# EAGLE design usbmidi2cv (EAGLE 9.6.2)
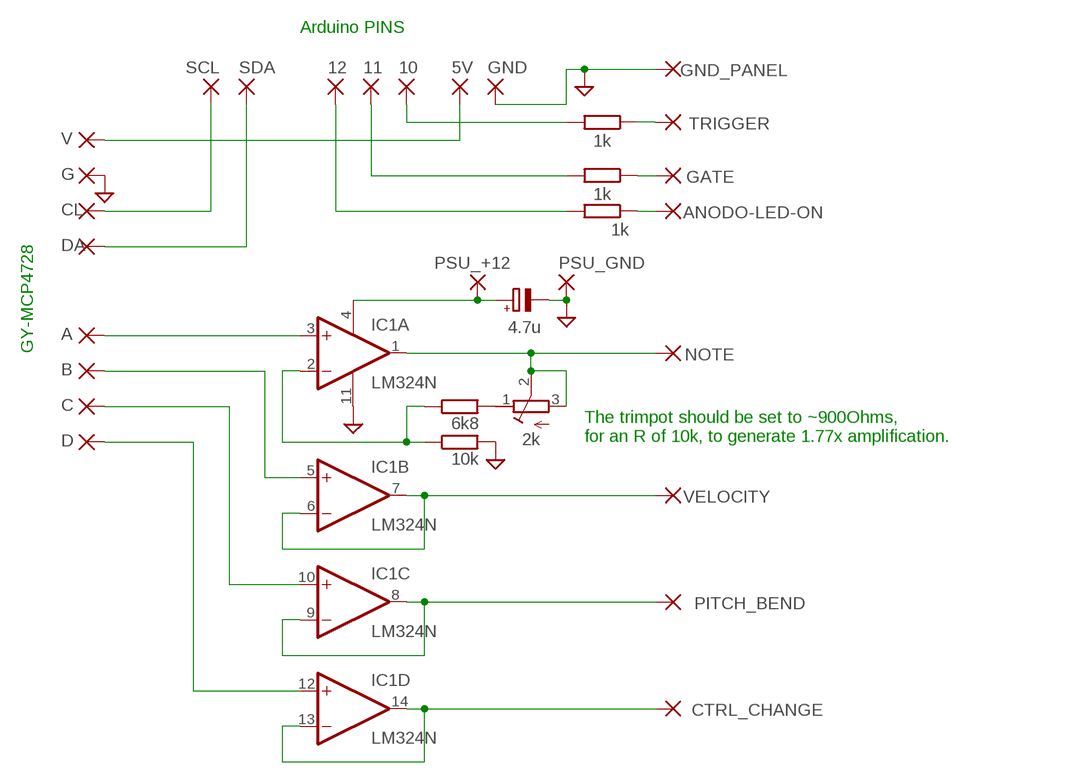
[diagram p0: schematic, sheet 1]

## Parts
5V  1,6/0,8  [1,6/0,8]
10  1,6/0,8  [1,6/0,8]
11  1,6/0,8  [1,6/0,8]
12  1,6/0,8  [1,6/0,8]
A  1,6/0,8  [1,6/0,8]
ANODO-LED-ON  1,6/0,8  [1,6/0,8]
B  1,6/0,8  [1,6/0,8]
C  1,6/0,8  [1,6/0,8]
C1  4.7u  CPOL-EUE2.5-6  [E2,5-6]
CL  1,6/0,8  [1,6/0,8]
CTRL_CHANGE  1,6/0,8  [1,6/0,8]
D  1,6/0,8  [1,6/0,8]
DA  1,6/0,8  [1,6/0,8]
G  1,6/0,8  [1,6/0,8]
GATE  1,6/0,8  [1,6/0,8]
GND  1,6/0,8  [1,6/0,8]
GND_PANEL  1,6/0,8  [1,6/0,8]
IC1  LM324N  [DIL14]
NOTE  1,6/0,8  [1,6/0,8]
PITCH_BEND  1,6/0,8  [1,6/0,8]
PSU_+12  1,6/0,8  [1,6/0,8]
PSU_GND  1,6/0,8  [1,6/0,8]
R1  1k  R-EU_0204/7  [0204/7]
R2  1k  R-EU_0204/7  [0204/7]
R3  1k  R-EU_0204/7  [0204/7]
R4  10k  R-EU_0207/12  [0207/12]
R5  2k  R-TRIMM3006P  [RTRIM3006P]
R6  6k8  R-EU_0207/12  [0207/12]
SCL  1,6/0,8  [1,6/0,8]
SDA  1,6/0,8  [1,6/0,8]
TRIGGER  1,6/0,8  [1,6/0,8]
V  1,6/0,8  [1,6/0,8]
VELOCITY  1,6/0,8  [1,6/0,8]

## Nets
GND: C1.- G.1(P) GND.1(P) GND_PANEL.1(P) IC1.11(P:V-) PSU_GND.1(P) R4.2
N$1: A.1(P) IC1.3(A:+IN)
N$2: R2.1 TRIGGER.1(P)
N$3: GATE.1(P) R1.1
N$4: 10.1(P) R2.2
N$5: 11.1(P) R1.2
N$6: ANODO-LED-ON.1(P) R3.1
N$7: 12.1(P) R3.2
N$8: 5V.1(P) V.1(P)
N$9: CL.1(P) SCL.1(P)
N$10: DA.1(P) SDA.1(P)
N$11: B.1(P) IC1.5(B:+IN)
N$12: C.1(P) IC1.10(C:+IN)
N$13: CTRL_CHANGE.1(P) IC1.13(D:-IN) IC1.14(D:OUT)
N$14: IC1.1(A:OUT) NOTE.1(P) R5.2(S) R5.3(A)
N$15: IC1.8(C:OUT) IC1.9(C:-IN) PITCH_BEND.1(P)
N$16: IC1.6(B:-IN) IC1.7(B:OUT) VELOCITY.1(P)
N$17: IC1.2(A:-IN) R4.1 R6.1
N$18: R5.1(E) R6.2
N$19: C1.+ IC1.4(P:V+) PSU_+12.1(P)
N$20: D.1(P) IC1.12(D:+IN)

## Notes on the sheet
- Arduino PINS
- GY-MCP4728
- The trimpot should be set to ~900Ohms,
  for an R of 10k, to generate 1.77x amplification.

## Library data of the parts
5V 10-12 A ANODO-LED-ON B C CL CTRL_CHANGE D DA G GATE GND GND_PANEL NOTE PITCH_BEND PSU_+12 PSU_GND SCL SDA TRIGGER V VELOCITY = wirepad:1,6/0,8: THROUGH-HOLE PAD
C1 = rcl:CPOL-EU: POLARIZED CAPACITOR, European symbol; SPICEPREFIX: C
IC1 = linear:LM324: OP AMP
R1-R4 R6 = rcl:R-EU_: RESISTOR, European symbol; SPICEPREFIX: R
R5 = rcl:R-TRIMM: Trimm resistor; SPICEMODEL: X; SPICEPREFIXL: POT

## Board
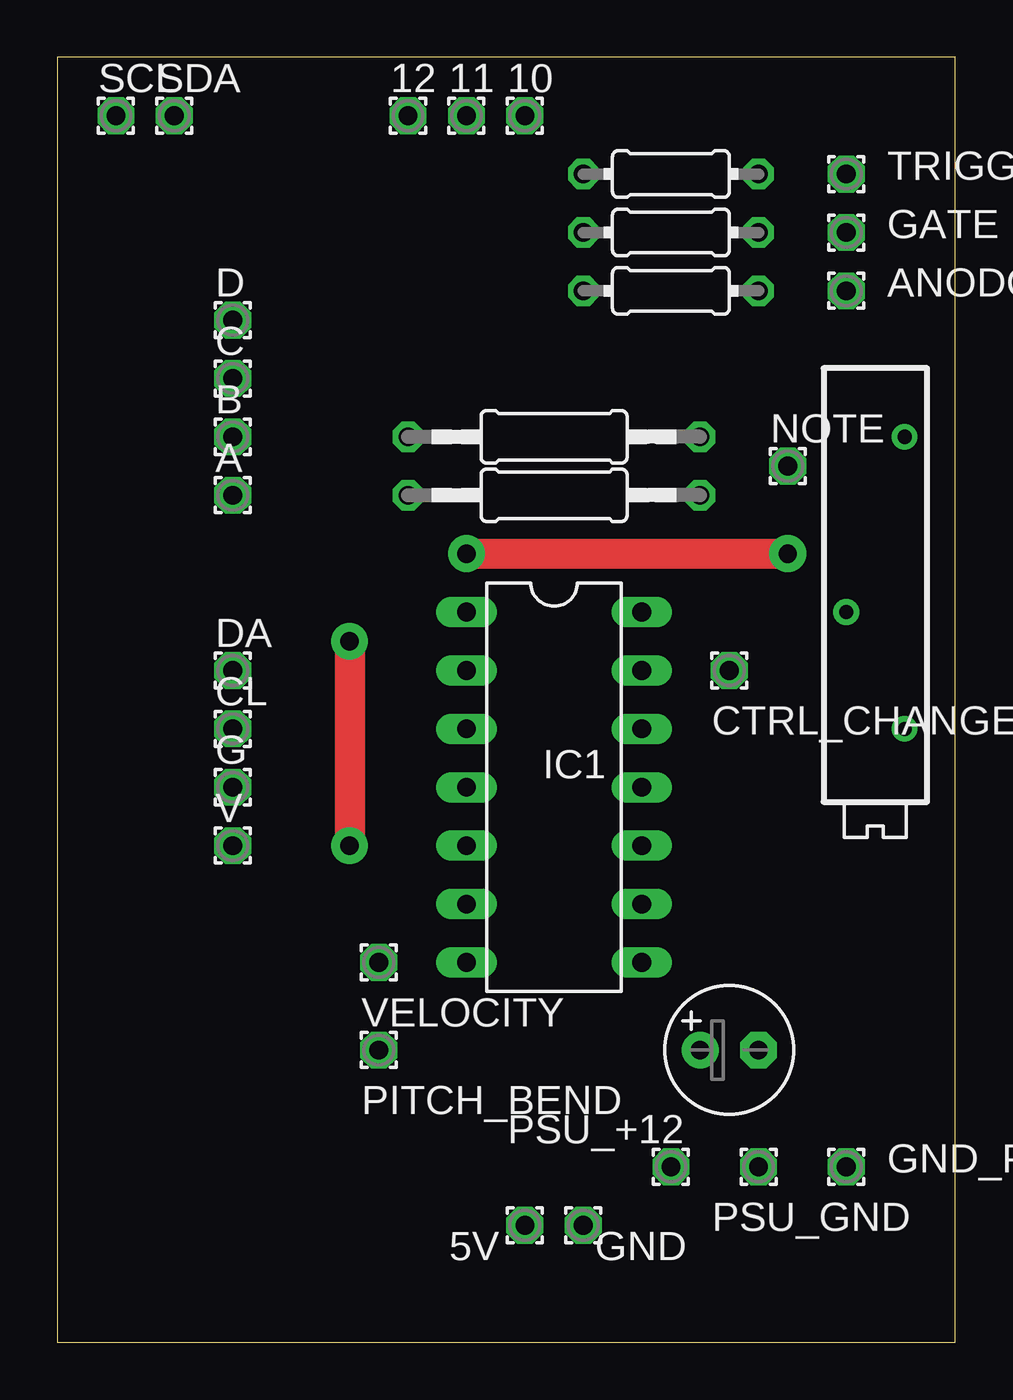
[diagram p1: board, top side]
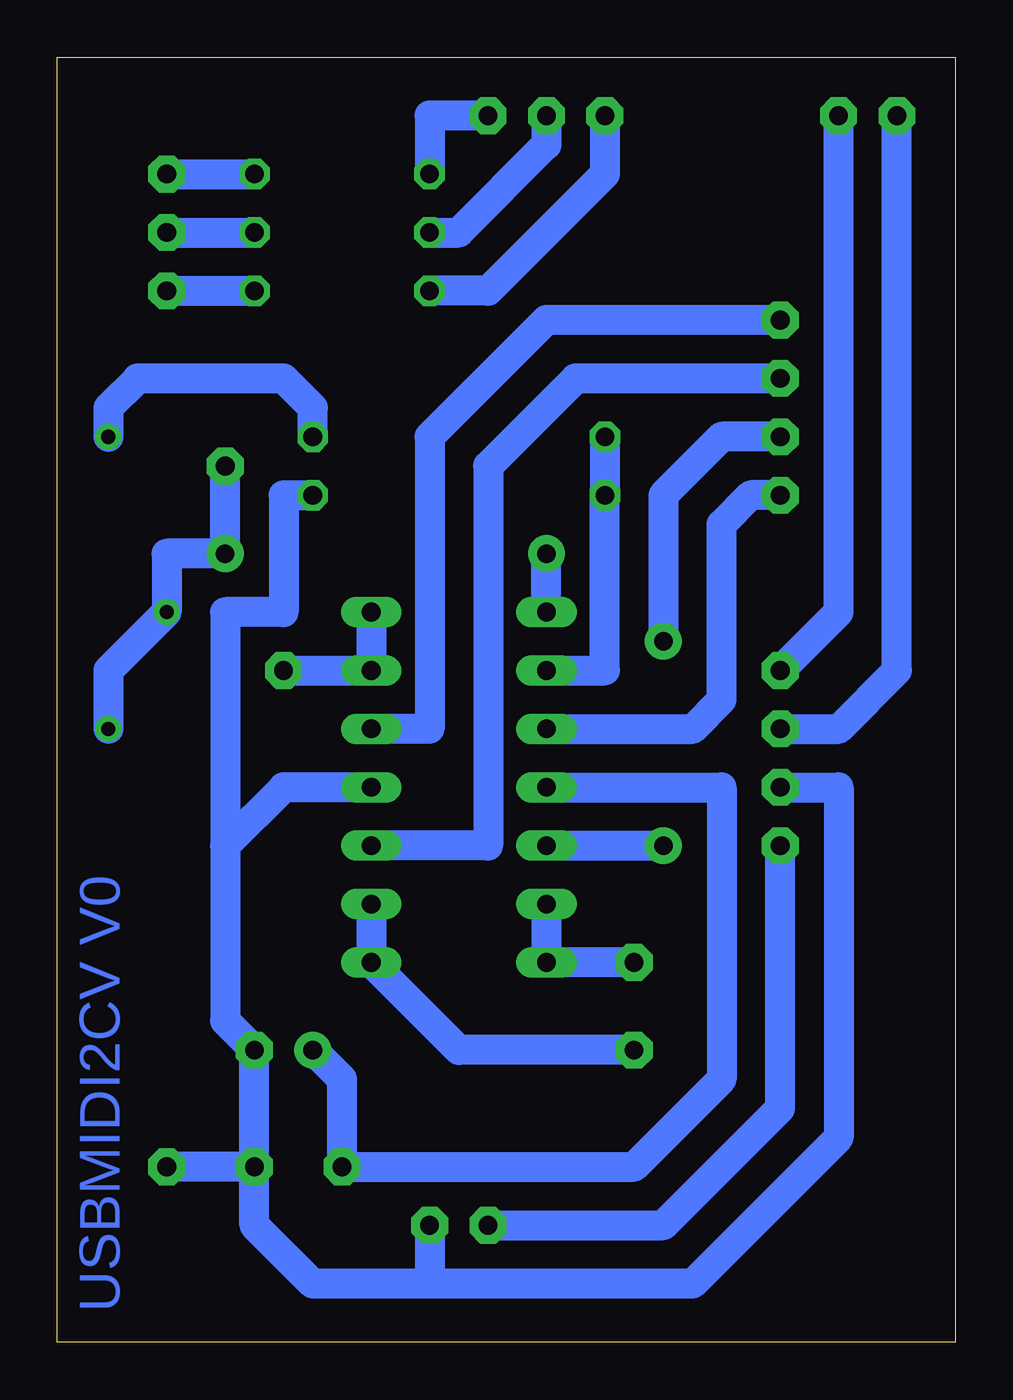
[diagram p2: board, bottom side, seen from below]

Size 39.04 x 55.87 mm. Coordinates in mm from the lower left corner, seen from the top.
Outline: 0,0 39.04,0 39.04,55.87 0,55.87 0,0
Copper layers (1*16): Top 0.035mm / dielectric 1.5mm / Bottom 0.035mm
Design rules "default": minimum track width 6mil, minimum drill 0.35mm, track to track 6mil, track to pad 6mil, pad to pad 6mil, via to via 6mil, smd to smd 6mil, copper to edge 40mil, drill to drill 6mil, minimum pad ring 10mil, minimum via ring 8mil, stop-mask expansion 4mil, vias tented up to drill 0mil, thermal gap 10mil

### Footprints (pad centres in the part's own frame; a part is rotated, then mirrored left to right if it is on the bottom)
1,6/0,8 = drill 0.813 pad 1.6 octagon: 1 0,0
E2,5-6 = drill 0.813 pad 1.6: + -1.27,0 | drill 0.813 pad 1.6 octagon: - 1.27,0
DIL14 = drill 0.813 long: 1 -7.62,-3.81; 2 -5.08,-3.81; 3 -2.54,-3.81; 4 0,-3.81; 5 2.54,-3.81; 6 5.08,-3.81; 7 7.62,-3.81; 8 7.62,3.81; 9 5.08,3.81; 10 2.54,3.81; 11 0,3.81; 12 -2.54,3.81; 13 -5.08,3.81; 14 -7.62,3.81
0204/7 = drill 0.813 octagon: 1 -3.81,0; 2 3.81,0
0207/12 = drill 0.813 octagon: 1 -6.35,0; 2 6.35,0
RTRIM3006P = drill 0.61: 1 -7.62,1.27; 2 0,-1.27; 3 5.08,1.27

### Placement (x,y rotation side)
5V  20.32,5.08 0 top
10  20.32,53.34 0 top
11  17.78,53.34 0 top
12  15.24,53.34 0 top
A  7.62,36.83 0 top
ANODO-LED-ON  34.29,45.72 0 top
B  7.62,39.37 0 top
C  7.62,41.91 0 top
C1  29.21,12.7 0 top
CL  7.62,26.67 0 top
CTRL_CHANGE  29.21,29.21 0 top
D  7.62,44.45 0 top
DA  7.62,29.21 0 top
G  7.62,24.13 0 top
GATE  34.29,48.26 0 top
GND  22.86,5.08 0 top
GND_PANEL  34.29,7.62 0 top
IC1  21.59,24.13 270 top
NOTE  31.75,38.1 0 top
PITCH_BEND  13.97,12.7 0 top
PSU_+12  26.67,7.62 0 top
PSU_GND  30.48,7.62 0 top
R1  26.67,48.26 180 top
R2  26.67,50.8 180 top
R3  26.67,45.72 180 top
R4  21.59,36.83 0 top
R5  35.56,31.75 270 top
R6  21.59,39.37 0 top
SCL  2.54,53.34 0 top
SDA  5.08,53.34 0 top
TRIGGER  34.29,50.8 0 top
V  7.62,21.59 0 top
VELOCITY  13.97,16.51 0 top

### Tracks (layer width: path | path; a pad name or v marks a point on that pad's centre or on a via)
GND
  Bottom 1.3: 22.86,2.54 11.43,2.54 5.08,8.89 5.08,24.13 G.1 | 22.86,2.54 27.94,2.54 30.48,5.08 PSU_GND.1 | IC1.11 29.21,24.13 31.75,21.59 | 31.75,21.59 31.75,13.97 C1.- PSU_GND.1 | R4.2 29.21,36.83 29.21,31.75 31.75,31.75 31.75,21.59 | GND.1 22.86,2.54 | PSU_GND.1 GND_PANEL.1
N$1
  Bottom 1.3: IC1.3 11.43,26.67 10.16,27.94 10.16,35.56 8.89,36.83 A.1
N$2
  Bottom 1.3: TRIGGER.1 R2.1
N$3
  Bottom 1.3: GATE.1 R1.1
N$4
  Bottom 1.3: R2.2 22.86,53.34 10.1
N$5
  Bottom 1.3: R1.2 21.59,48.26 17.78,52.07 11.1
N$6
  Bottom 1.3: ANODO-LED-ON.1 R3.1
N$7
  Bottom 1.3: R3.2 20.32,45.72 15.24,50.8 12.1
N$8
  Bottom 1.3: V.1 7.62,10.16 12.7,5.08 5V.1
N$9
  Bottom 1.3: CL.1 5.08,26.67 2.54,29.21 SCL.1
N$10
  Bottom 1.3: DA.1 5.08,31.75 SDA.1
N$11  (via drill 0.35, 0.8 pad 1.6)
  Top 1.3: v12.7,30.48 v12.7,21.59
  Bottom 1.3: IC1.5 v12.7,21.59 | v12.7,30.48 12.7,36.83 10.16,39.37 B.1
N$12
  Bottom 1.3: IC1.10 20.32,21.59 20.32,38.1 16.51,41.91 C.1
N$13
  Bottom 1.3: IC1.14 IC1.13 CTRL_CHANGE.1
N$14  (via drill 0.35, 0.8 pad 1.6)
  Top 1.3: v17.78,34.29 v31.75,34.29
  Bottom 1.3: IC1.1 v17.78,34.29 | NOTE.1 v31.75,34.29 34.29,34.29 R5.2 36.83,29.21 R5.3
N$15
  Bottom 1.3: IC1.9 IC1.8 21.59,12.7 PITCH_BEND.1
N$16
  Bottom 1.3: IC1.6 IC1.7 VELOCITY.1
N$17
  Bottom 1.3: R6.1 R4.1 15.24,29.21 IC1.2
N$18
  Bottom 1.3: R6.2 27.94,40.64 29.21,41.91 35.56,41.91 36.83,40.64 R5.1
N$19
  Bottom 1.3: IC1.4 10.16,24.13 10.16,11.43 13.97,7.62 PSU_+12.1 26.67,11.43 C1.+
N$20
  Bottom 1.3: IC1.12 22.86,26.67 22.86,39.37 17.78,44.45 D.1

### Text on the board
Bottom: USBMIDI2CV V0